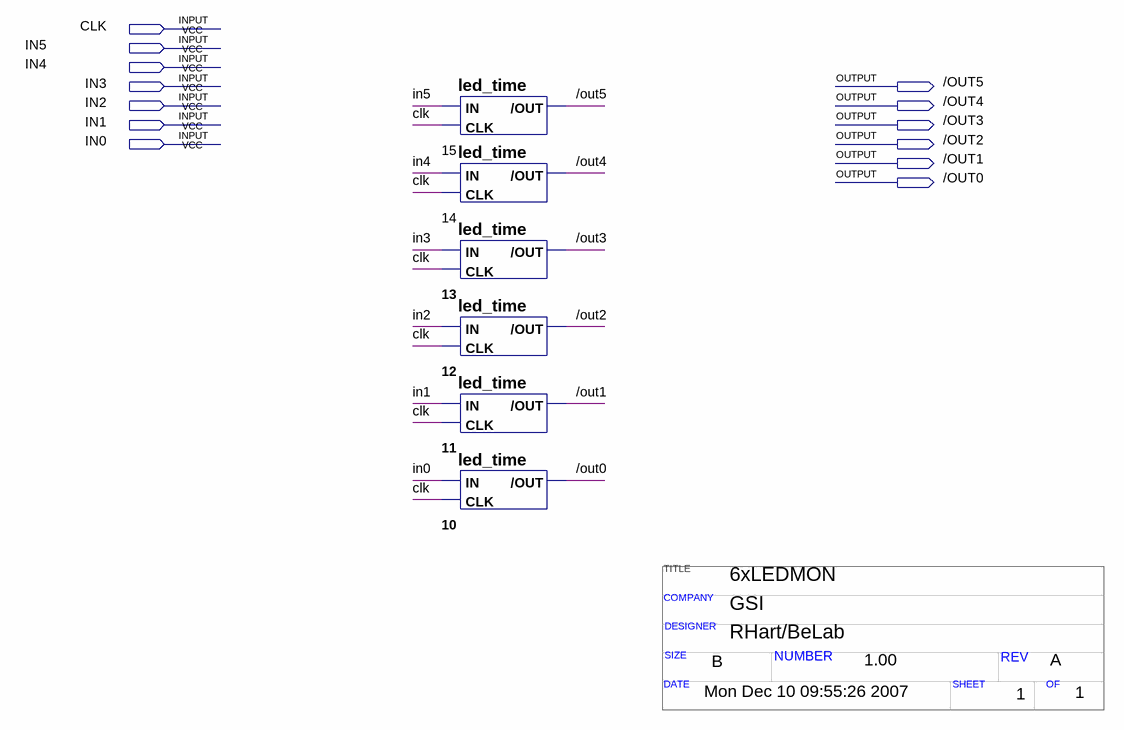
[diagram p0: schematic sheet]
// Quartus schematic 6xledmon.bdf as structural Verilog: 6 symbols, 13 pins
// Title block: TITLE: 6xLEDMON; COMPANY: GSI; DESIGNER: RHart/BeLab; SIZE: B; NUMBER: 1.00; REV: A; DATE: Mon Dec 10 09:55:26 2007; SHEET: 1; OF: 1
module \6xledmon  (
  input  CLK,
  input  IN5,
  input  IN4,
  input  IN3,
  input  IN2,
  input  IN1,
  input  IN0,
  output \/OUT5 ,
  output \/OUT4 ,
  output \/OUT3 ,
  output \/OUT2 ,
  output \/OUT1 ,
  output \/OUT0 
);

  led_time u_15 (.IN(IN5), .CLK(CLK), .\/OUT (\/OUT5 ));
  led_time u_14 (.IN(IN4), .CLK(CLK), .\/OUT (\/OUT4 ));
  led_time u_13 (.IN(IN3), .CLK(CLK), .\/OUT (\/OUT3 ));
  led_time u_12 (.IN(IN2), .CLK(CLK), .\/OUT (\/OUT2 ));
  led_time u_11 (.IN(IN1), .CLK(CLK), .\/OUT (\/OUT1 ));
  led_time u_10 (.IN(IN0), .CLK(CLK), .\/OUT (\/OUT0 ));
endmodule
